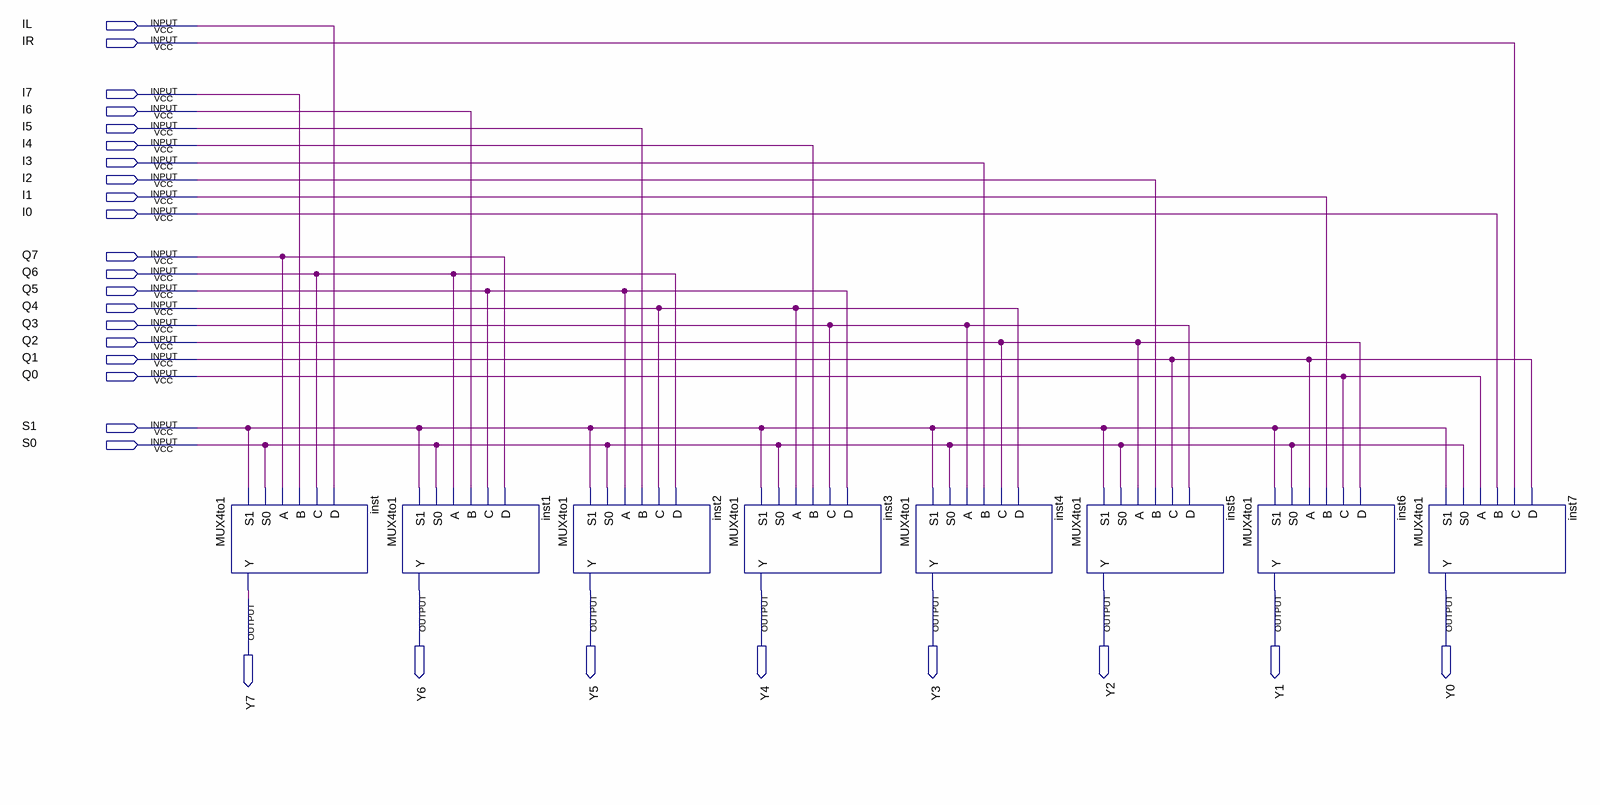
[diagram p0: schematic sheet]
// Quartus schematic Control.bdf as structural Verilog: 8 symbols, 28 pins
module Control (
  input  IL,
  input  IR,
  input  I7,
  input  I6,
  input  I5,
  input  I4,
  input  I3,
  input  I2,
  input  I1,
  input  I0,
  input  Q7,
  input  Q6,
  input  Q5,
  input  Q4,
  input  Q3,
  input  Q2,
  input  Q1,
  input  Q0,
  input  S1,
  input  S0,
  output Y6,
  output Y5,
  output Y4,
  output Y3,
  output Y2,
  output Y1,
  output Y0,
  output Y7
);

  MUX4to1 inst (.S1(S1), .S0(S0), .A(Q7), .B(I7), .C(Q6), .D(IL), .Y(Y7));
  MUX4to1 inst1 (.S1(S1), .S0(S0), .A(Q6), .B(I6), .C(Q5), .D(Q7), .Y(Y6));
  MUX4to1 inst2 (.S1(S1), .S0(S0), .A(Q5), .B(I5), .C(Q4), .D(Q6), .Y(Y5));
  MUX4to1 inst3 (.S1(S1), .S0(S0), .A(Q4), .B(I4), .C(Q3), .D(Q5), .Y(Y4));
  MUX4to1 inst4 (.S1(S1), .S0(S0), .A(Q3), .B(I3), .C(Q2), .D(Q4), .Y(Y3));
  MUX4to1 inst5 (.S1(S1), .S0(S0), .A(Q2), .B(I2), .C(Q1), .D(Q3), .Y(Y2));
  MUX4to1 inst6 (.S1(S1), .S0(S0), .A(Q1), .B(I1), .C(Q0), .D(Q2), .Y(Y1));
  MUX4to1 inst7 (.S1(S1), .S0(S0), .A(Q0), .B(I0), .C(IR), .D(Q1), .Y(Y0));
endmodule
